# EAGLE design RC_MUX (EAGLE 6.4)
DATABASE: /home/mes/eagle/PARTSDB.txt
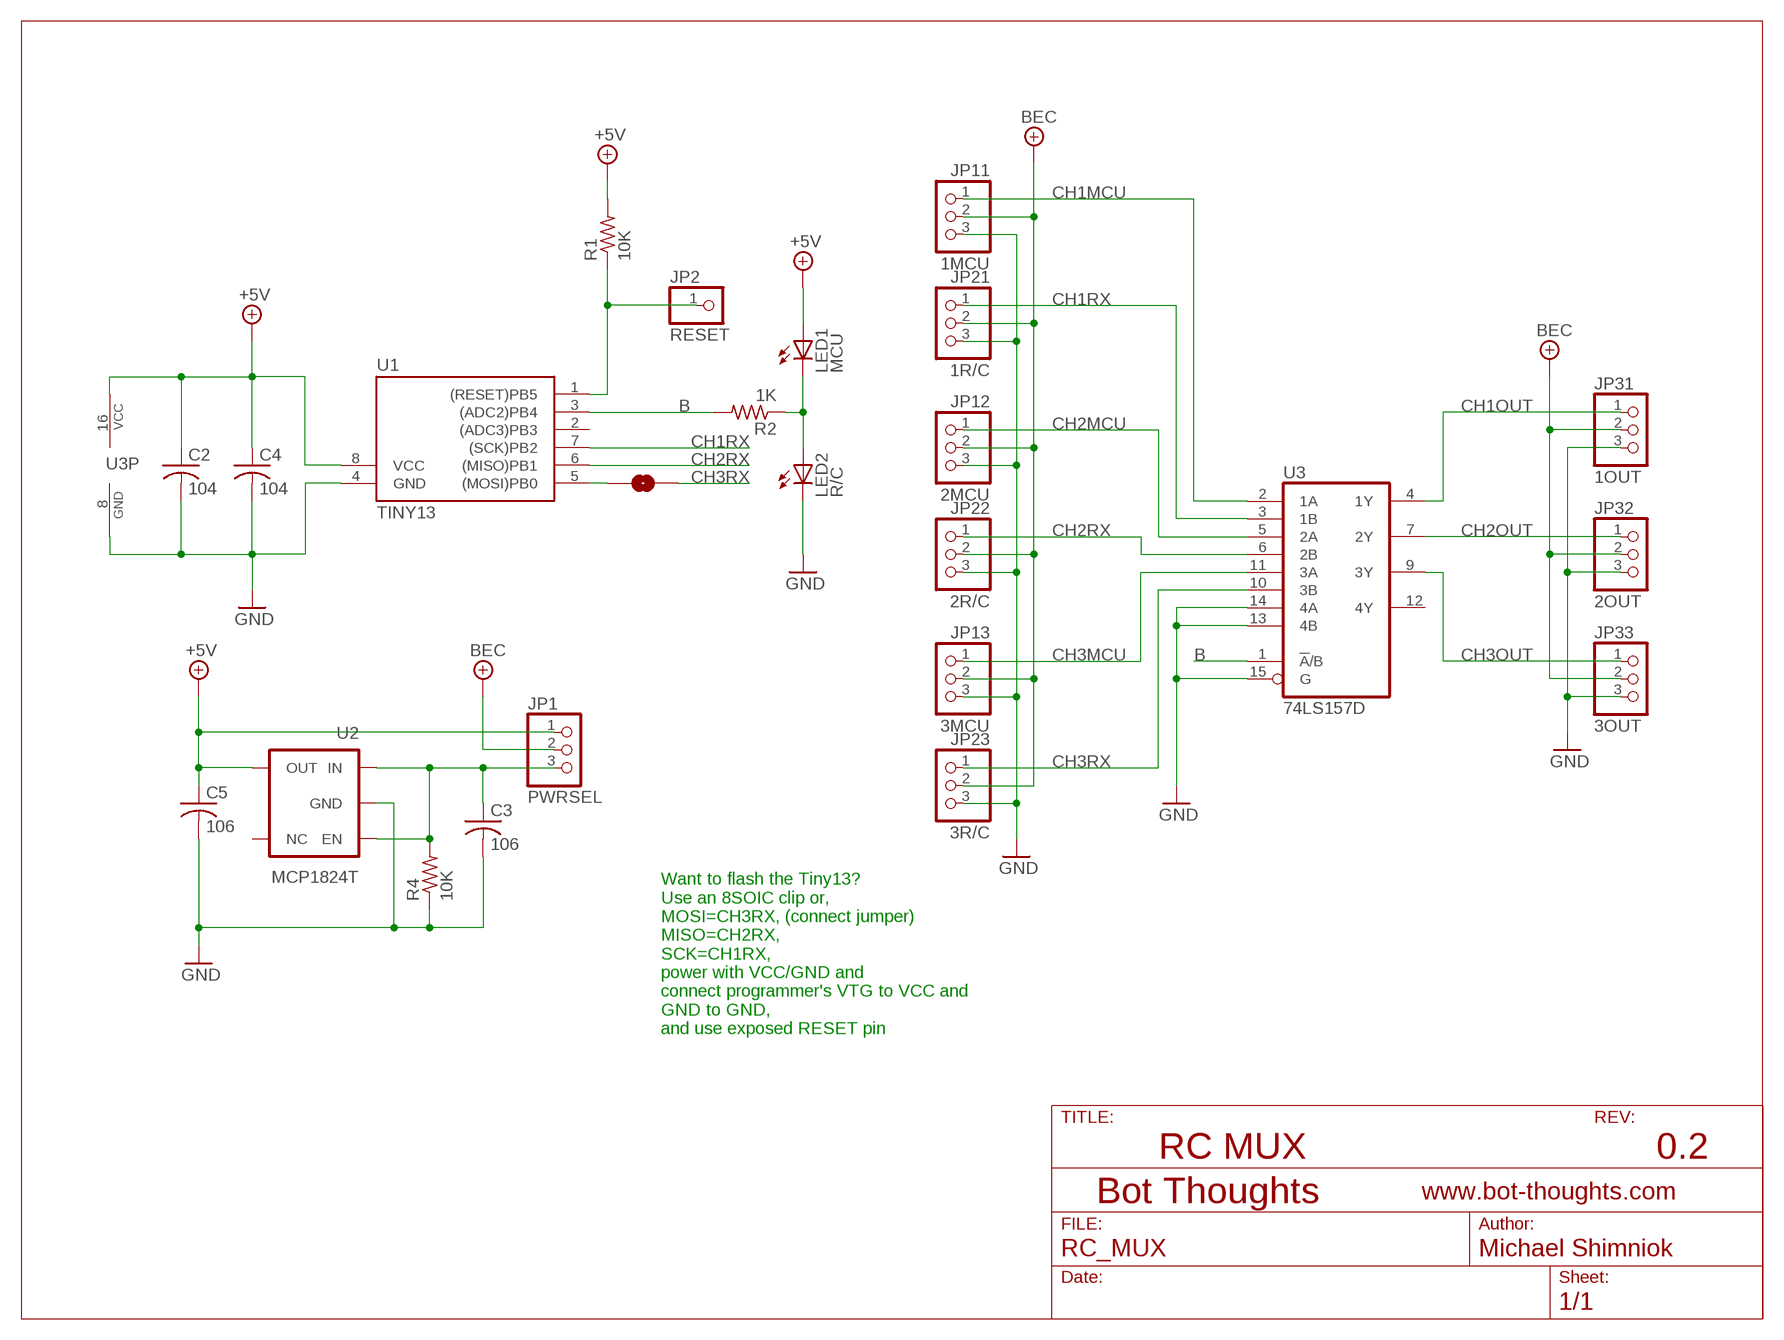
[diagram p0: schematic, sheet 1]

## Parts
C2  104  C-USC0603  [C0603]
C3  106  C-USC0603  [C0603]
C4  104  C-USC0603  [C0603]
C5  106  C-USC0603  [C0603]
JP1  PWRSEL  PINHD-1X03_2.00  [1X03M]
JP2  RESET  PINHD-1X01_2.54-S  [1X01-S]
JP11  1MCU  PINHD-1X03_2.54-S  [1X03-S]
JP12  2MCU  PINHD-1X03_2.54-S  [1X03-S]
JP13  3MCU  PINHD-1X03_2.54-S  [1X03-S]
JP21  1R/C  PINHD-1X03_2.54-S  [1X03-S]
JP22  2R/C  PINHD-1X03_2.54-S  [1X03-S]
JP23  3R/C  PINHD-1X03_2.54-S  [1X03-S]
JP31  1OUT  PINHD-1X03_2.54-S  [1X03-S]
JP32  2OUT  PINHD-1X03_2.54-S  [1X03-S]
JP33  3OUT  PINHD-1X03_2.54-S  [1X03-S]
LED1  MCU  LEDCHIPLED_1206  [CHIPLED_1206]
LED2  R/C  LEDCHIPLED_1206  [CHIPLED_1206]
R1  10K  R-US_R0603  [R0603]
R2  1K  R-US_R0603  [R0603]
R4  10K  R-US_R0603  [R0603]
SJ1  CH3  SOLDERJUMPERNC2  [SJ_2S-NOTRACE]
U1  TINY13  TINY138S2  [SO08]
U2  MCP1824T  MCP1801  [SOT23-5]
U3  74LS157D  [SO16]

## Nets
!RESET: JP2.1 R1.1 U1.1((RESET)PB5)
+5V: C2.1 C4.1 C5.1 JP1.1 LED1.A R1.2 U1.8(VCC) U2.5(OUT) U3.16(VCC)
+7V: JP1.2 JP11.2 JP12.2 JP13.2 JP21.2 JP22.2 JP23.2 JP31.2 JP32.2 JP33.2 ; supply symbol labelled BEC
B: R2.2 U1.3((ADC2)PB4) U3.1(!A!/B)
CH1MCU: JP11.1 U3.2(1A)
CH1OUT: JP31.1 U3.4(1Y)
CH1RX: JP21.1 U1.7((SCK)PB2) U3.3(1B)
CH2MCU: JP12.1 U3.5(2A)
CH2OUT: JP32.1 U3.7(2Y)
CH2RX: JP22.1 U1.6((MISO)PB1) U3.6(2B)
CH3MCU: JP13.1 U3.11(3A)
CH3OUT: JP33.1 U3.9(3Y)
CH3RX: JP23.1 SJ1.2 U3.10(3B)
GND: C2.2 C3.2 C4.2 C5.2 JP11.3 JP12.3 JP13.3 JP21.3 JP22.3 JP23.3 JP31.3 JP32.3 JP33.3 LED2.C R4.1 U1.4(GND) U2.2(GND) U3.8(GND) U3.13(4B) U3.14(4A) U3.15(G)
LEDS: LED1.C LED2.A R2.1
N$1: SJ1.1 U1.5((MOSI)PB0)
REGIN: C3.1 JP1.3 R4.2 U2.1(IN) U2.3(EN)
Unconnected: U1.2((ADC3)PB3) U2.4(NC) U3.12(4Y)

## Notes on the sheet
- Want to flash the Tiny13?
  Use an 8SOIC clip or, 
  MOSI=CH3RX, (connect jumper)
  MISO=CH2RX, 
  SCK=CH1RX, 
  power with VCC/GND and 
  connect programmer's VTG to VCC and
  GND to GND,
  and use exposed RESET pin
- RC MUX | 0.2

## Library data of the parts
C2 C4 = rcl:C-US: CAPACITOR, American symbol; PARTNO: C1608X7R1E104K080AA
C3 C5 = rcl:C-US: CAPACITOR, American symbol; PARTNO: CL10A106MP8NNNC
JP1 JP11-JP13 JP21-JP23 JP31-JP33 = pinhead-2:PINHD-1X03: PIN HEADER
JP2 = pinhead-2:PINHD-1X01: PIN HEADER
LED1 = led:LED: LED OSRAM: - CHIPLED LG R971, LG N971, LY N971, LG Q971, LY Q971, LO R971, LY R971 LH N974, LH R974 LS Q976, LO Q976, LY Q976 LO Q996 - Hyper CHIPLED LW Q18S LB Q993, LB Q99A, LB R99A - SideLED LS A670, LO A670, LY A670, LG A670, LP A670 LB A673, LV A673, LT A673, LW A673 LH A674 LY A675 LS A676, LA A676, LO A676, LY A676, LW A676 LS A679, LY A679, LG A679 - Hyper Micro SIDELED® LS Y876, LA Y876, LO Y876, LY Y876 LT Y87S - SmartLED LW L88C, LW L88S LB L89C, LB L89S, LG L890 LS L89K, LO L89K, LY L89K LS L896, LA L896, LO L896, LY L896 - TOPLED LS T670, LO T670, LY T670, LG T670, LP T670 LSG T670, LSP T670, LSY T670, LOP T670, LYG T670 LG T671, LOG T671, LSG T671 LB T673, LV T673, LT T673, LW T673 LH T674 LS T676, LA T676, LO T676, LY T676, LB T676, LH T676, LSB T676, LW T676 LB T67C, LV T67C, LT T67C, LS T67K, LO T67K, LY T67K, LW E67C LS E67B, LA E67B, LO E67B, LY E67B, LB E67C, LV E67C, LT E67C LW T67C LS T679, LY T679, LG T679 LS T770, LO T770, LY T770, LG T770, LP T770 LB T773, LV T773, LT T773, LW T773 LH T774 LS E675, LA E675, LY E675, LS T675 LS T776, LA T776, LO T776, LY T776, LB T776 LHGB T686 LT T68C, LB T68C - Hyper Mini TOPLED® LB M676 - Mini TOPLED Santana® LG M470 LS M47K, LO M47K, LY M47K Source: http://www.osram.convergy.de LUXEON: - LUMILED® LXK2-PW12-R00, LXK2-PW12-S00, LXK2-PW14-U00, LXK2-PW14-V00 LXK2-PM12-R00, LXK2-PM12-S00, LXK2-PM14-U00 LXK2-PE12-Q00, LXK2-PE12-R00, LXK2-PE12-S00, LXK2-PE14-T00, LXK2-PE14-U00 LXK2-PB12-K00, LXK2-PB12-L00, LXK2-PB12-M00, LXK2-PB14-N00, LXK2-PB14-P00, LXK2-PB14-Q00 LXK2-PR12-L00, LXK2-PR12-M00, LXK2-PR14-Q00, LXK2-PR14-R00 LXK2-PD12-Q00, LXK2-PD12-R00, LXK2-PD12-S00 LXK2-PH12-R00, LXK2-PH12-S00 LXK2-PL12-P00, LXK2-PL12-Q00, LXK2-PL12-R00 Source: www.luxeon.com KINGBRIGHT: KA-3528ASYC Source: www.kingbright.com; PARTNO: LH N974-KN-1
LED2 = led:LED: LED OSRAM: - CHIPLED LG R971, LG N971, LY N971, LG Q971, LY Q971, LO R971, LY R971 LH N974, LH R974 LS Q976, LO Q976, LY Q976 LO Q996 - Hyper CHIPLED LW Q18S LB Q993, LB Q99A, LB R99A - SideLED LS A670, LO A670, LY A670, LG A670, LP A670 LB A673, LV A673, LT A673, LW A673 LH A674 LY A675 LS A676, LA A676, LO A676, LY A676, LW A676 LS A679, LY A679, LG A679 - Hyper Micro SIDELED® LS Y876, LA Y876, LO Y876, LY Y876 LT Y87S - SmartLED LW L88C, LW L88S LB L89C, LB L89S, LG L890 LS L89K, LO L89K, LY L89K LS L896, LA L896, LO L896, LY L896 - TOPLED LS T670, LO T670, LY T670, LG T670, LP T670 LSG T670, LSP T670, LSY T670, LOP T670, LYG T670 LG T671, LOG T671, LSG T671 LB T673, LV T673, LT T673, LW T673 LH T674 LS T676, LA T676, LO T676, LY T676, LB T676, LH T676, LSB T676, LW T676 LB T67C, LV T67C, LT T67C, LS T67K, LO T67K, LY T67K, LW E67C LS E67B, LA E67B, LO E67B, LY E67B, LB E67C, LV E67C, LT E67C LW T67C LS T679, LY T679, LG T679 LS T770, LO T770, LY T770, LG T770, LP T770 LB T773, LV T773, LT T773, LW T773 LH T774 LS E675, LA E675, LY E675, LS T675 LS T776, LA T776, LO T776, LY T776, LB T776 LHGB T686 LT T68C, LB T68C - Hyper Mini TOPLED® LB M676 - Mini TOPLED Santana® LG M470 LS M47K, LO M47K, LY M47K Source: http://www.osram.convergy.de LUXEON: - LUMILED® LXK2-PW12-R00, LXK2-PW12-S00, LXK2-PW14-U00, LXK2-PW14-V00 LXK2-PM12-R00, LXK2-PM12-S00, LXK2-PM14-U00 LXK2-PE12-Q00, LXK2-PE12-R00, LXK2-PE12-S00, LXK2-PE14-T00, LXK2-PE14-U00 LXK2-PB12-K00, LXK2-PB12-L00, LXK2-PB12-M00, LXK2-PB14-N00, LXK2-PB14-P00, LXK2-PB14-Q00 LXK2-PR12-L00, LXK2-PR12-M00, LXK2-PR14-Q00, LXK2-PR14-R00 LXK2-PD12-Q00, LXK2-PD12-R00, LXK2-PD12-S00 LXK2-PH12-R00, LXK2-PH12-S00 LXK2-PL12-P00, LXK2-PL12-Q00, LXK2-PL12-R00 Source: www.luxeon.com KINGBRIGHT: KA-3528ASYC Source: www.kingbright.com; PARTNO: LG N971-KN-1
R1 R4 = rcl:R-US_: RESISTOR, American symbol; PARTNO: 1622829-1
R2 = rcl:R-US_: RESISTOR, American symbol; PARTNO: RC0603JR-07330RL
SJ1 = SparkFun:SOLDERJUMPER: Solder Jumper Standard SMD solder jumper. Used to automate production. Two varients : Normally Open and Normally Closed are the same, but have different paste layers. NC will have a large amount of paste and should jumper during reflow.
U1 = avr-7:TINY13*; PARTNO: ATTINY13A-SSH
U2 = mes_regulators:MCP1801: Microchip MCP1801 LDO Regulator The MCP1801 is a family of CMOS low dropout (LDO) voltage regulators that can deliver up to 150 mA of current while consuming only 25 μA of quiescent current (typical) with input operating range from 2.0V to 10.0V. Datasheet.pdf <http://ww1.microchip.com/downloads/en/DeviceDoc/22051D.pdf>; PARTNO: MCP1824T-5002E/OT
U3 = 74xx-us:74*157: Quadruple 2-line to 1-line data SELECTOR/MULTIPLEXER; PARTNO: 74HCT157D,652

## Board
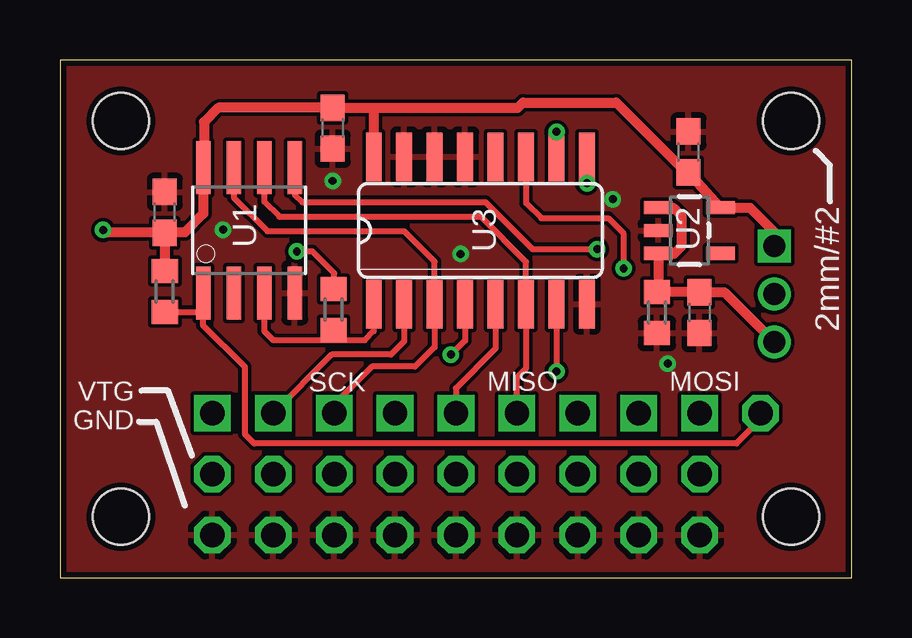
[diagram p1: board, top side]
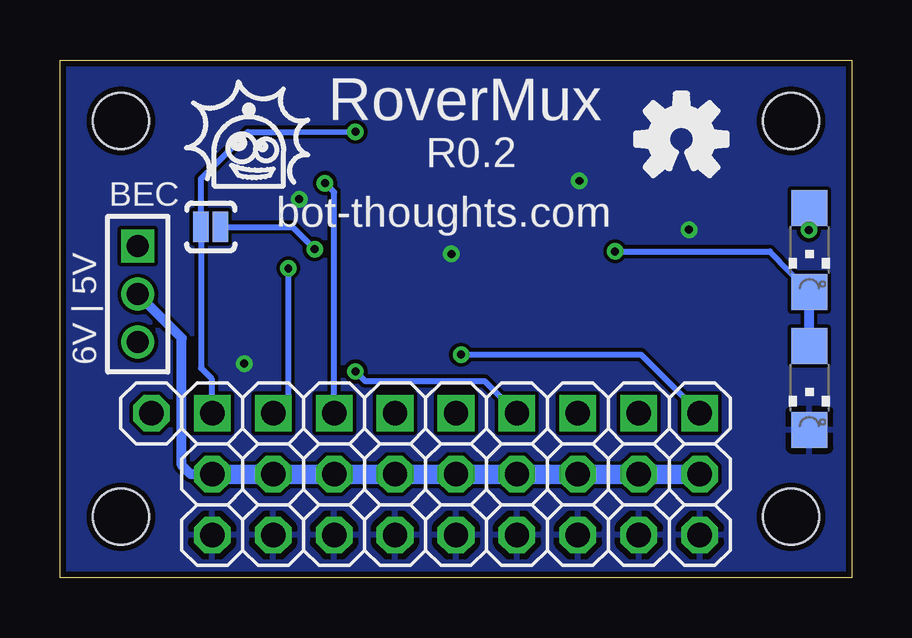
[diagram p2: board, bottom side, seen from below]

Size 33.02 x 21.59 mm. Coordinates in mm from the lower left corner, seen from the top.
Outline: 0,0 33.02,0 33.02,21.59 0,21.59 0,0
Copper layers (1*16): Top 0.0356mm / dielectric 1.5011mm / Bottom 0.0356mm
Design rules "LaenPCBOrder *": minimum track width 6mil, minimum drill 13mil, track to track 6mil, track to pad 6mil, pad to pad 6mil, via to via 6mil, smd to smd 6mil, copper to edge 10mil, drill to drill 6mil, minimum pad ring 7mil, minimum via ring 7mil, stop-mask expansion 4mil, vias tented up to drill 20mil, thermal gap 10mil
Holes 2.34 mm at 30.48,2.54 30.48,19.05 2.54,2.54 2.54,19.05

### Footprints (pad centres in the part's own frame; a part is rotated, then mirrored left to right if it is on the bottom)
C0603 = smd 1.1 x 1: 1 -0.85,0; 2 0.85,0
1X03M = drill 0.914 square: 1 -2,0 | drill 0.914: 2 0,0; 3 2,0
1X01-S = drill 1.016 octagon: 1 0,0
1X03-S = drill 1.016 square: 1 -2.54,0 | drill 1.016 octagon: 2 0,0; 3 2.54,0
CHIPLED_1206 = smd 1.5 x 1.5: A 0,-1.75; C 0,1.75
R0603 = smd 1 x 1.1: 1 -0.85,0; 2 0.85,0
SJ_2S-NOTRACE = smd 0.635 x 1.27: 1 -0.401,0; 2 0.413,0
SO08 = smd 0.61 x 2.21: 1 -1.905,-2.616; 2 -0.635,-2.616; 3 0.635,-2.616; 4 1.905,-2.616; 5 1.905,2.616; 6 0.635,2.616; 7 -0.635,2.616; 8 -1.905,2.616
SOT23-5 = smd 0.55 x 1.2: 1 -0.95,-1.3; 2 0,-1.3; 3 0.95,-1.3; 4 0.95,1.3; 5 -0.95,1.3
SO16 = smd 0.66 x 2.032: 1 -4.445,-3.073; 2 -3.175,-3.073; 3 -1.905,-3.073; 4 -0.635,-3.073; 5 0.635,-3.073; 6 1.905,-3.073; 7 3.175,-3.073; 8 4.445,-3.073; 9 4.445,3.073; 10 3.175,3.073; 11 1.905,3.073; 12 0.635,3.073; 13 -0.635,3.073; 14 -1.905,3.073; 15 -3.175,3.073; 16 -4.445,3.073

### Placement (x,y rotation side)
C2  4.37,15.24 90 top
C3  26.66,11.05 270 top
C4  11.37,18.74 270 top
C5  26.2,17.75 90 top
JP1  29.77,11.82 270 bottom
JP2  29.21,6.86 90 bottom
JP11  8.89,4.32 270 bottom
JP12  16.51,4.32 270 bottom
JP13  24.13,4.32 270 bottom
JP21  11.43,4.32 270 bottom
JP22  19.05,4.32 270 bottom
JP23  26.67,4.32 270 bottom
JP31  6.35,4.32 270 bottom
JP32  13.97,4.32 270 bottom
JP33  21.59,4.32 270 bottom
LED1  1.78,13.67 180 bottom
LED2  1.78,7.92 180 bottom
R1  4.37,11.94 90 top
R2  11.41,11.18 270 top
R4  24.89,11.05 90 top
SJ1  26.73,14.63 180 bottom
U1  7.88,14.49 0 top
U2  26.24,14.48 270 top
U3  17.53,14.48 0 top

### Tracks (layer width: path | path; a pad name or v marks a point on that pad's centre or on a via)
!RESET
  Top 0.254: JP2.1 29.11,6.51 28.2,5.6 8.1,5.6 7.7,6 7.7,8.8 5.95,10.55 5.95,11.1 5.95,11.85 | R1.1 5.94,11.09
  Top 0.406: 5.95,11.85 U1.1 | 5.94,11.09 5.95,11.1
+5V  (via drill 0.33)
  Top 0.406: C2.1 R1.2 | 13.08,19.59 C4.1 6.59,19.59 6,19 6,17.13 U1.8 5.98,15.18 5.2,14.4 4.38,14.4 C2.1 | 13.08,19.59 U3.16 | 13.08,19.59 19.09,19.59 19.3,19.81 23.19,19.81 26.3,16.7 C5.1 27.5,15.46 U2.5 28.77,15.43 29.77,14.42 JP1.1 | C2.1 1.91,14.39 v1.8,14.5
  Bottom 0.406: LED1.A 1.78,15.02 v1.8,14.5
+7V
  Bottom 0.406: JP23.2 27.56,4.32 27.94,4.69 27.94,9.99 JP1.2
  Bottom 0.813: JP23.2 JP13.2 JP33.2 JP22.2 JP12.2 JP32.2 JP21.2 JP11.2 JP31.2
B
  Top 0.254: U3.1 13.08,10.28 12.7,9.9 11.4,9.9 | 11.4,9.9 8.9,9.9 8.52,10.28 U1.3 | R2.2 11.41,9.91 11.4,9.9
CH1MCU
  Top 0.254: U3.2 14.35,9.85 13.8,9.3 11.33,9.3 JP11.1
CH1OUT  (via drill 0.33)
  Top 0.254: U3.4 16.89,9.89 v16.3,9.3
  Bottom 0.254: v16.3,9.3 8.79,9.3 JP31.1
CH1RX
  Top 0.254: U1.7 7.25,15.85 8.65,14.45 14.35,14.45 15.62,13.18 U3.3 15.62,9.62 14.8,8.8 13,8.8 11.43,7.23 JP21.1
CH2MCU
  Top 0.254: U3.5 18.16,9.56 16.5,7.9 JP12.1
CH2OUT  (via drill 0.33)
  Top 0.254: U3.7 v20.7,8.6
  Bottom 0.254: v20.7,8.6 20.3,8.2 15.31,8.2 JP32.1
CH2RX
  Top 0.254: U1.6 8.52,15.68 9.15,15.05 17.55,15.05 19.43,13.17 U3.6 19.43,8.73 19.05,8.35 JP22.1
CH3MCU  (via drill 0.33)
  Top 0.254: U3.11 19.43,15.62 20.07,14.99 22.86,14.99 23.5,14.35 v23.5,12.9
  Bottom 0.254: v23.5,12.9 23.5,7.49 JP13.1
CH3OUT  (via drill 0.33)
  Top 0.254: v21.97,16.45 U3.9
  Bottom 0.254: JP33.1 21.59,16.07 v21.97,16.45
CH3RX  (via drill 0.33)
  Top 0.254: v20.7,18.59 U3.10
  Bottom 0.254: v20.7,18.59 23.23,18.58 25.19,18.58 27.14,16.63 SJ1.2 27.14,8.74 26.7,8.3 26.7,6.89 JP23.1
GND  (via drill 0.33)
  other vias: 16.7,13.5 6.79,14.52 25.34,8.93 11.37,16.55 23.05,15.79
  pour Bottom: 33.02,21.59 0,21.59 0,0 33.02,0
  pour Top: 33.02,21.59 0,21.59 0,0 33.02,0
LEDS  (via drill 0.33)
  Top 0.254: R2.1 11.43,12.7 10.52,13.61 v9.88,13.61 9.83,13.61
  Bottom 0.254: v9.88,13.61 3.42,13.61 LED1.C
  Bottom 0.406: LED2.A LED1.C
N$1  (via drill 0.33)
  Top 0.254: U1.5 9.79,15.96 10.1,15.65 17.75,15.65 19.7,13.7 v22.4,13.7
  Bottom 0.254: SJ1.1 23.33,14.63 v22.4,13.7
REGIN
  Top 0.406: U2.1 25.57,15.43 25.9,15.1 25.9,13.8 25.6,13.5 24.77,13.5 U2.3 24.94,11.85 R4.2 C3.1 27.69,11.9 JP1.3

### Text on the board
tPlace: 2mm/#2
bPlace: BEC | 6V | 5V
tNames: VTG | SCK | MISO | MOSI | GND
bNames: RoverMux | R0.2 | bot-thoughts.com
tsilk: C4 | C5 | C2 | U2 | C3 | R2 | R1 | R3 | U1 | U3
bsilk: RC MUX | R0.1 | BOT-THOUGHTS.COM | BEC | AUTO | 1OUT | 1MCU | 1RX | 2OUT | 2MCU | 2RX | 3OUT | 3MCU | 3RX | 5V | 6V | MAN | SIG>